# EAGLE design lightsaber (EAGLE 8.2.2)
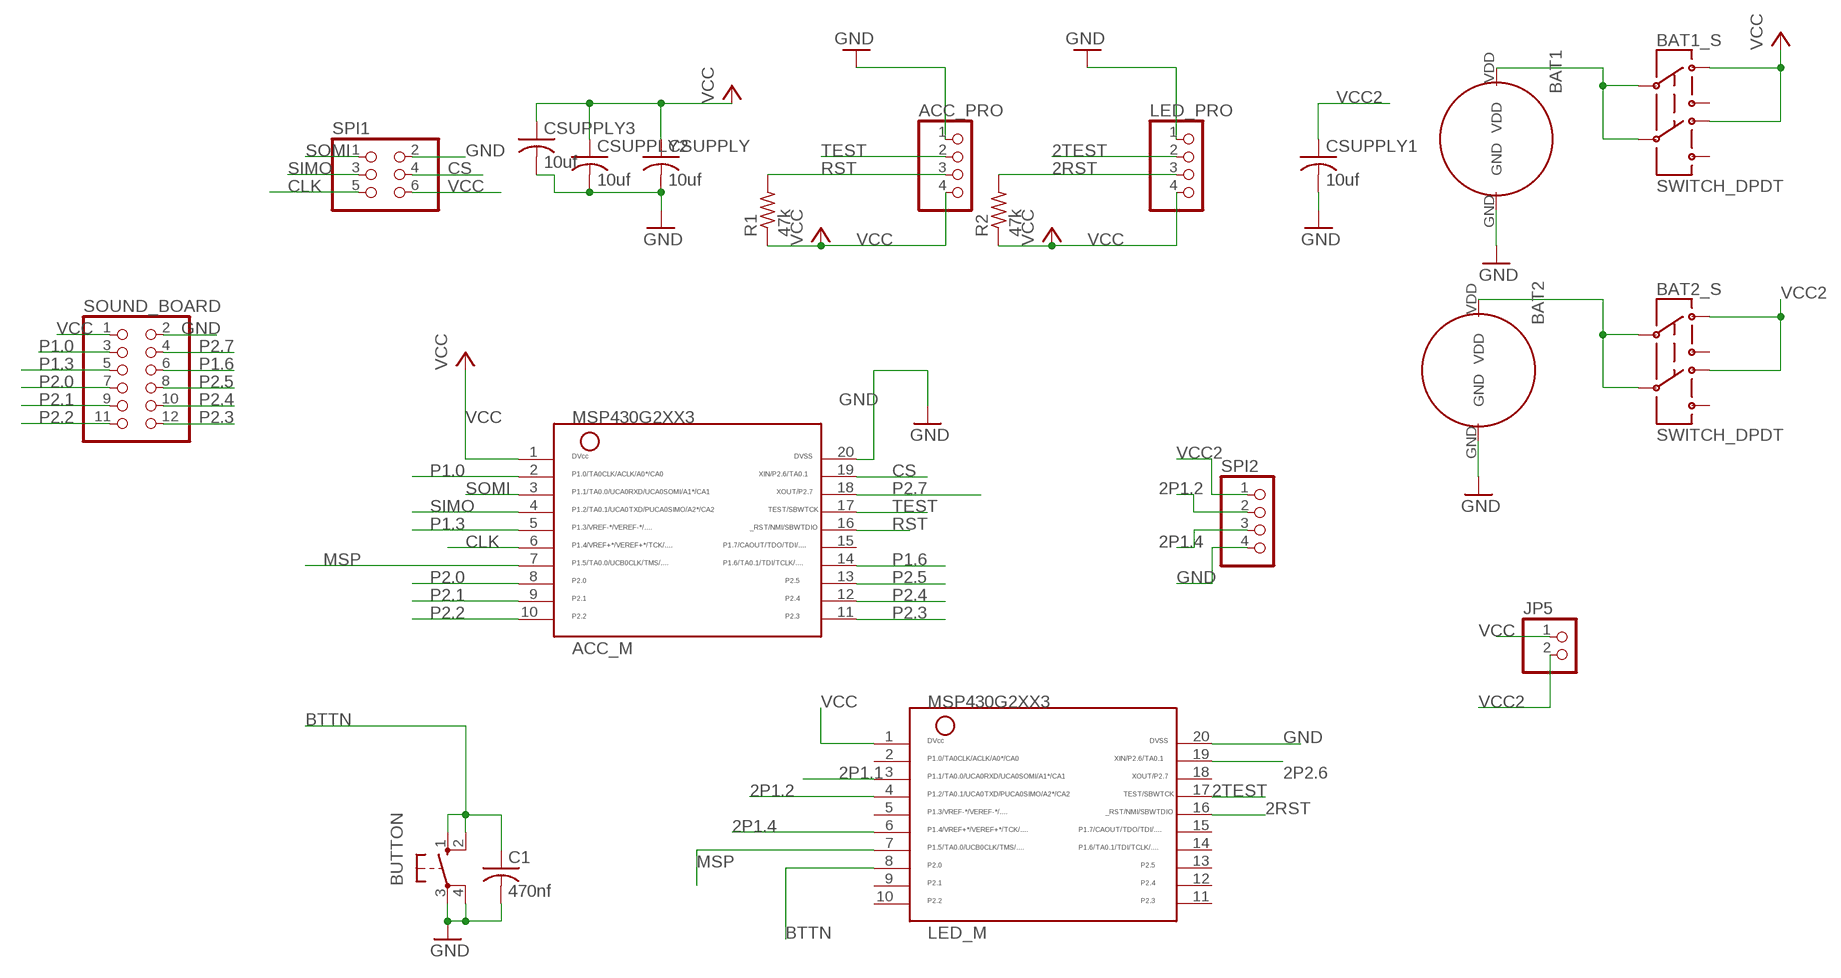
[diagram p0: schematic, sheet 1]

## Parts
ACC_M  MSP430G2XX3TSSOP  [PW20]
ACC_PRO  PINHD-1X4  [1X04]
BAT1  BAT_PAD  [BATTERY_PAD1]
BAT1_S  SWITCH_DPDT  [JS_DPDT_TH]
BAT2  BAT_PAD  [BATTERY_PAD1]
BAT2_S  SWITCH_DPDT  [JS_DPDT_TH]
BUTTON  10-XX  [B3F-10XX]
C1  470nf  C-USC1206  [C1206]
CSUPPLY  10uf  C-USC1206  [C1206]
CSUPPLY1  10uf  C-USC1206  [C1206]
CSUPPLY2  10uf  C-USC1206  [C1206]
CSUPPLY3  10uf  C-USC1206  [C1206]
JP5  PINHD-1X2  [1X02]
LED_M  MSP430G2XX3TSSOP  [PW20]
LED_PRO  PINHD-1X4  [1X04]
R1  47k  R-US_R1206  [R1206]
R2  47k  R-US_R1206  [R1206]
SOUND_BOARD  PINHD-2X6  [2X06]
SPI1  PINHD-2X3  [2X03]
SPI2  PINHD-1X4  [1X04]

## Nets
2P1.1: LED_M.3
2P1.2: LED_M.4 SPI2.2
2P1.4: LED_M.6 SPI2.3
2P2.6: LED_M.19
2RST: LED_M.16 LED_PRO.3 R2.2
2TEST: LED_M.17 LED_PRO.2
BAT_VCC: BAT1.VDD BAT1_S.2 BAT1_S.5
BAT_VCC2: BAT2.VDD BAT2_S.2 BAT2_S.5
BTTN: BUTTON.1(S) BUTTON.2(S1) C1.1 LED_M.8
CLK: ACC_M.6 SPI1.5
CS: ACC_M.19 SPI1.4
GND: ACC_M.20 ACC_PRO.1 BAT1.GND BAT2.GND BUTTON.3(P) BUTTON.4(P1) C1.2 CSUPPLY1.2 CSUPPLY2.2 CSUPPLY3.2 CSUPPLY.2 LED_M.20 LED_PRO.1 SOUND_BOARD.2 SPI1.2 SPI2.4
MSP: ACC_M.7 LED_M.7
P1.0: ACC_M.2 SOUND_BOARD.3
P1.3: ACC_M.5 SOUND_BOARD.5
P1.6: ACC_M.14 SOUND_BOARD.6
P2.0: ACC_M.8 SOUND_BOARD.7
P2.1: ACC_M.9 SOUND_BOARD.9
P2.2: ACC_M.10 SOUND_BOARD.11
P2.3: ACC_M.11 SOUND_BOARD.12
P2.4: ACC_M.12 SOUND_BOARD.10
P2.5: ACC_M.13 SOUND_BOARD.8
P2.7: ACC_M.18 SOUND_BOARD.4
RST: ACC_M.16 ACC_PRO.3 R1.2
SIMO: ACC_M.4 SPI1.3
SOMI: ACC_M.3 SPI1.1
TEST: ACC_M.17 ACC_PRO.2
VCC: ACC_M.1 ACC_PRO.4 BAT1_S.1 BAT1_S.4 CSUPPLY2.1 CSUPPLY3.1 CSUPPLY.1 JP5.1 LED_M.1 LED_PRO.4 R1.1 R2.1 SOUND_BOARD.1 SPI1.6
VCC2: BAT2_S.1 BAT2_S.4 CSUPPLY1.1 JP5.2 SPI2.1
Unconnected: ACC_M.15 BAT1_S.3 BAT1_S.6 BAT2_S.3 BAT2_S.6 LED_M.2 LED_M.5 LED_M.9 LED_M.10 LED_M.11 LED_M.12 LED_M.13 LED_M.14 LED_M.15 LED_M.18

## Library data of the parts
ACC_M LED_M = ELEC327:MSP430G2XX3: MSP430G2XX3 PDIP (N) 20 Pin Package
ACC_PRO LED_PRO SPI2 = pinhead:PINHD-1X4: PIN HEADER
BAT1 BAT2 = BAT_PAD:BAT_PAD
BAT1_S BAT2_S = ELEC327:SWITCH_DPDT
BUTTON = switch-omron:10-XX: OMRON SWITCH; MPN: B3F-1000; OC_FARNELL: 176432; OC_NEWARK: 36M3542
C1 CSUPPLY CSUPPLY1-CSUPPLY3 = rcl:C-US: CAPACITOR, American symbol
JP5 = pinhead:PINHD-1X2: PIN HEADER
R1 R2 = resistor:R-US_: RESISTOR, American symbol
SOUND_BOARD = pinhead:PINHD-2X6: PIN HEADER
SPI1 = pinhead:PINHD-2X3: PIN HEADER

## Board
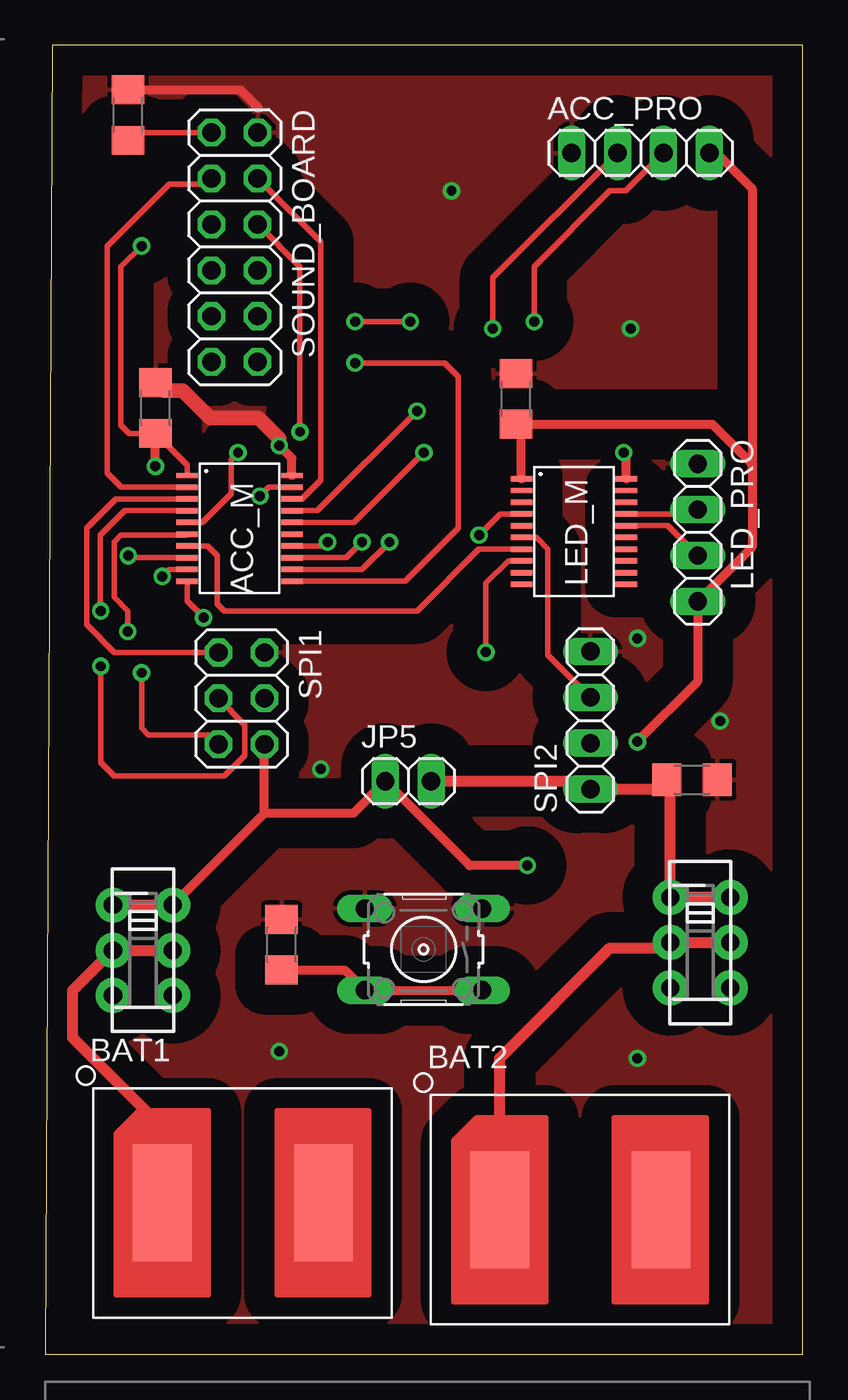
[diagram p1: board, top side]
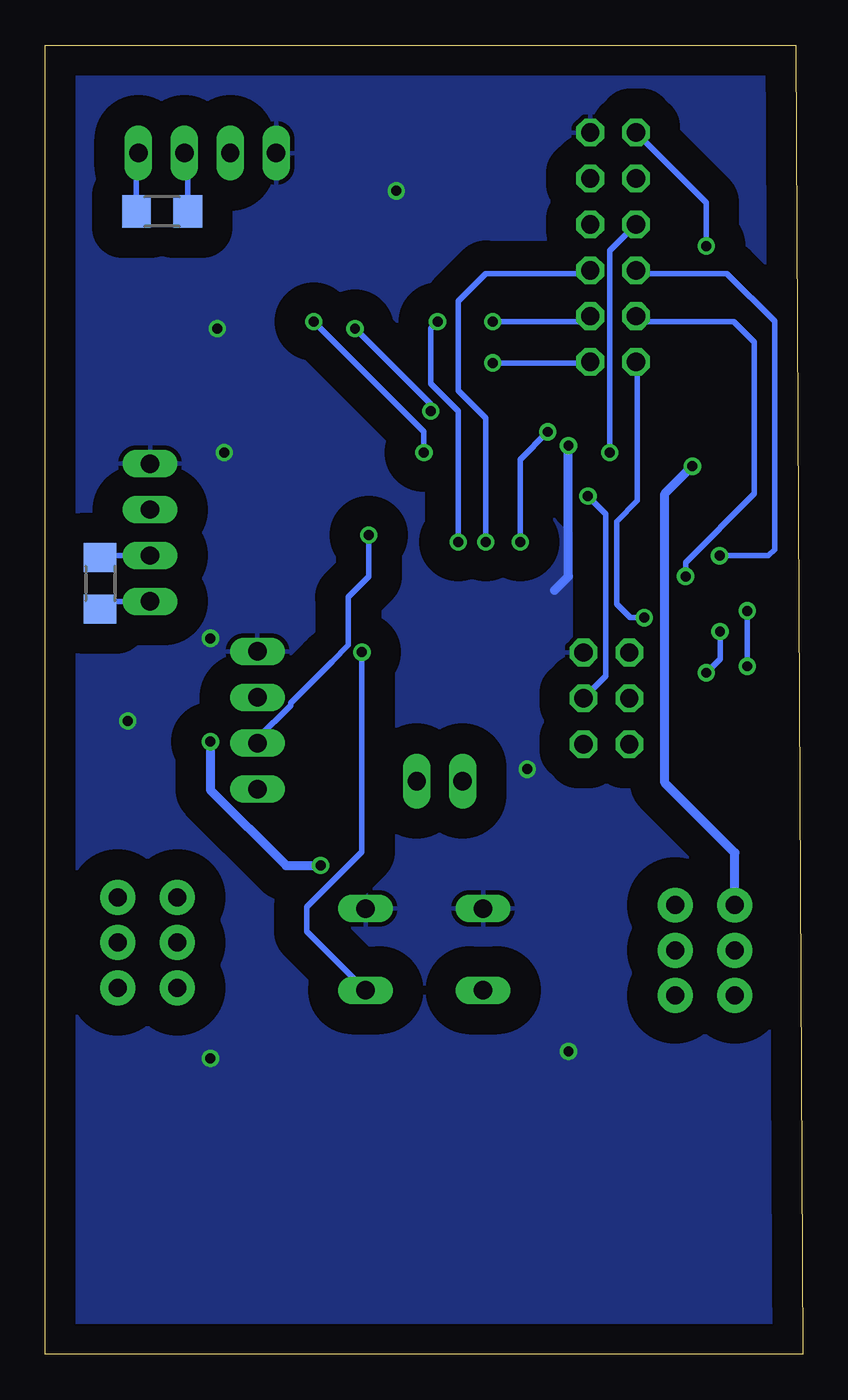
[diagram p2: board, bottom side, seen from below]

Size 41.91 x 72.45 mm. Coordinates in mm from the lower left corner, seen from the top.
Outline: 0,0 41.91,0 41.91,72.45 0.38,72.45 0,0
Copper layers (1*16): Top 0.035mm / dielectric 1.5mm / Bottom 0.035mm
Design rules "default": minimum track width 6mil, minimum drill 0.35mm, track to track 6mil, track to pad 6mil, pad to pad 6mil, via to via 6mil, smd to smd 6mil, copper to edge 40mil, drill to drill 6mil, minimum pad ring 10mil, minimum via ring 8mil, stop-mask expansion 4mil, vias tented up to drill 0mil, thermal gap 10mil

### Footprints (pad centres in the part's own frame; a part is rotated, then mirrored left to right if it is on the bottom)
PW20 = smd 0.3 x 1.2: 1 -2.925,-2.9; 2 -2.275,-2.9; 3 -1.625,-2.9; 4 -0.975,-2.9; 5 -0.325,-2.9; 6 0.325,-2.9; 7 0.975,-2.9; 8 1.625,-2.9; 9 2.275,-2.9; 10 2.925,-2.9; 11 2.925,2.9; 12 2.275,2.9; 13 1.625,2.9; 14 0.975,2.9; 15 0.325,2.9; 16 -0.325,2.9; 17 -0.975,2.9; 18 -1.625,2.9; 19 -2.275,2.9; 20 -2.925,2.9
1X04 = drill 1.016 long: 1 -3.81,0; 2 -1.27,0; 3 1.27,0; 4 3.81,0
BATTERY_PAD1 = smd 3.251 x 6.452: GND 8.92,0; VDD 0,0
JS_DPDT_TH = drill 1 pad 1.93: 1 -2.5,-1.65; 2 0,-1.65; 3 2.5,-1.65; 4 -2.5,1.65; 5 0,1.65; 6 2.5,1.65
B3F-10XX = drill 1.016 long: 1 -3.251,2.261; 2 3.251,2.261; 3 -3.251,-2.261; 4 3.251,-2.261
C1206 = smd 1.6 x 1.8: 1 -1.4,0; 2 1.4,0
1X02 = drill 1.016 long: 1 -1.27,0; 2 1.27,0
R1206 = smd 1.6 x 1.803: 1 -1.422,0; 2 1.422,0
2X06 = drill 1.016 octagon: 1 -6.35,-1.27; 2 -6.35,1.27; 3 -3.81,-1.27; 4 -3.81,1.27; 5 -1.27,-1.27; 6 -1.27,1.27; 7 1.27,-1.27; 8 1.27,1.27; 9 3.81,-1.27; 10 3.81,1.27; 11 6.35,-1.27; 12 6.35,1.27
2X03 = drill 1.016 octagon: 1 -2.54,-1.27; 2 -2.54,1.27; 3 0,-1.27; 4 0,1.27; 5 2.54,-1.27; 6 2.54,1.27

### Placement (x,y rotation side)
ACC_M  10.75,45.71 270 top
ACC_PRO  32.94,66.49 0 top
BAT1  6.48,8.38 0 top
BAT1_S  5.4,22.36 270 top
BAT2  25.15,8 0 top
BAT2_S  36.24,22.79 270 top
BUTTON  20.93,22.41 180 top
C1  13.08,22.67 90 top
CSUPPLY  6.11,52.37 90 top
CSUPPLY1  35.79,31.8 0 top
CSUPPLY2  26.05,52.88 90 top
CSUPPLY3  4.57,68.58 90 top
JP5  20.08,31.72 0 top
LED_M  29.25,45.53 270 top
LED_PRO  36.1,45.48 270 top
R1  35.43,63.25 0 bottom
R2  38.86,42.67 90 bottom
SOUND_BOARD  10.48,61.27 270 top
SPI1  10.86,36.3 270 top
SPI2  30.16,35.09 90 top

### Tracks (layer width: path | path; a pad name or v marks a point on that pad's centre or on a via)
2P1.2  (via drill 0.55)
  Top 0.305: LED_M.4 25.17,46.51 v24,45.34
  Bottom 0.305: v24,45.34 24,43.05 25.15,41.91 25.15,39.24 26.04,38.35 | 26.04,38.35 26.29,38.1 | 26.04,38.35 28.33,36.06 28.33,35.92 30.16,34.09 SPI2.2
2P1.4
  Top 0.305: LED_M.6 27.18,45.2 27.81,44.58 27.81,38.71 SPI2.3
2RST
  Top 0.305: LED_M.16 34.46,45.85 LED_PRO.3
  Bottom 0.305: LED_PRO.3 38.75,44.21 R2.2
2TEST
  Top 0.305: LED_M.17 35.86,46.51 LED_PRO.2
BAT_VCC
  Top 0.61: BAT1_S.5 BAT1_S.2 1.52,20.13 1.52,17.53 6.48,12.57 BAT1.VDD
BAT_VCC2
  Top 0.61: BAT2.VDD 25.15,16.38 31.24,22.48 34.28,22.48 BAT2_S.2 BAT2_S.5
BTTN  (via drill 0.55)
  Top 0.305: LED_M.8 25.62,43.91 24.38,42.67 v24.38,38.86
  Top 0.508: C1.1 16.56,21.27 BUTTON.2 BUTTON.1
  Bottom 0.305: v24.38,38.86 24.38,27.81 27.43,24.77 27.43,23.4 BUTTON.1
CLK  (via drill 0.55)
  Top 0.305: v5.33,37.72 5.33,34.67 5.71,34.29 9.06,34.29 SPI1.5 | v4.57,40.01 4.57,41.15 3.81,41.91 3.81,44.96 4.19,45.34 7.81,45.34 ACC_M.6
  Bottom 0.305: v4.57,40.01 4.57,38.48 v5.33,37.72
CS  (via drill 0.55)
  Top 0.305: ACC_M.19 12.37,47.98 v11.88,47.5
  Bottom 0.305: SPI1.4 10.88,37.55 10.88,46.5 v11.88,47.5
GND  (via drill 0.55)
  Top 0.508: CSUPPLY3.2 10.79,69.98 11.81,68.96 | LED_M.20 32.15,49.76 v32,49.91 | ACC_M.20 13.65,49.59 v12.95,50.29
  Top 0.813: v12.95,50.29 12.95,50.67 11.81,51.82 9.14,51.82 7.62,53.34 6.53,53.34 CSUPPLY.2
  Bottom 0.508: v12.95,50.29 12.95,43.05 13.72,42.29
  other vias: 32.77,39.62 37.34,35.05 15.24,32.38 22.48,64.39 32.38,56.77 12.95,16.76 32.77,16.38
  pour Top (isolate 1.676): 0,-1 0.38,72.57 42.02,72.57 42.02,-1
  pour Bottom (isolate 1.676): 0,-1 0.38,72.57 42.02,72.57 42.02,-1
MSP
  Top 0.305: ACC_M.7 8.99,44.73 9.53,44.2 9.53,41.53 9.91,41.15 20.57,41.15 23.98,44.56 LED_M.7 26.33,44.58
P1.0
  Top 0.305: ACC_M.2 4.21,47.98 3.43,48.77 3.43,61.34 6.86,64.77 8.9,64.77 SOUND_BOARD.3
P1.3  (via drill 0.55)
  Top 0.305: ACC_M.5 8.7,46.03 10.29,47.62 10.29,49.53 v10.67,49.91
  Bottom 0.305: v10.67,49.91 10.67,61.08 SOUND_BOARD.5
P1.6  (via drill 0.55)
  Top 0.305: ACC_M.14 15.4,44.73 v15.62,44.96 | v14.1,51.05 14.1,60.19 SOUND_BOARD.6
  Bottom 0.305: v15.62,44.96 15.62,49.53 v14.1,51.05
P2.0  (via drill 0.55)
  Top 0.305: ACC_M.8 4.7,44.09 v4.59,44.2
  Bottom 0.305: v4.59,44.2 1.91,44.2 1.55,44.55 1.55,57.17 4.19,59.82 9.03,59.82 SOUND_BOARD.7
P2.1  (via drill 0.55)
  Top 0.305: ACC_M.9 6.86,43.44 v6.48,43.05
  Bottom 0.305: v6.48,43.05 6.48,43.81 2.67,47.62 2.67,56.01 3.81,57.15 8.9,57.15 SOUND_BOARD.9
P2.2  (via drill 0.55)
  Top 0.305: ACC_M.10 7.85,41.68 v8.76,40.77
  Bottom 0.305: v8.76,40.77 9.53,40.77 10.29,41.53 10.29,46.1 9.14,47.24 9.14,54.85 SOUND_BOARD.11
P2.3  (via drill 0.55)
  Top 0.305: 22.61,54.35 22.86,54.1 | 22.61,54.35 22.1,54.86 v17.14,54.86 | 22.86,54.1 22.86,45.72 19.93,42.78 ACC_M.11 | 22.86,54.1 22.61,54.35
  Bottom 0.305: v17.14,54.86 11.8,54.86 SOUND_BOARD.12
P2.4  (via drill 0.55)
  Top 0.305: v20.19,57.15 v17.14,57.15 | v19.05,44.96 17.53,43.44 ACC_M.12
  Bottom 0.305: v20.19,57.15 20.57,56.77 20.57,53.72 19.05,52.2 v19.05,44.96 | v17.14,57.15 12.06,57.15 SOUND_BOARD.10
P2.5  (via drill 0.55)
  Top 0.305: v17.53,44.96 16.65,44.09 ACC_M.13
  Bottom 0.305: SOUND_BOARD.8 11.93,59.82 17.53,59.82 19.05,58.29 19.05,53.34 17.53,51.82 v17.53,44.96
P2.7
  Top 0.305: ACC_M.18 14.19,47.34 15.24,48.39 15.24,61.59 SOUND_BOARD.4
RST  (via drill 0.55)
  Top 0.305: ACC_M.16 17.08,46.03 v20.96,49.91 | v27.05,57.15 27.05,60.2 31.24,64.39 32.11,64.39 ACC_PRO.3
  Bottom 0.305: v20.96,49.91 20.96,51.05 v27.05,57.15 | R1.2 34.01,66.29 ACC_PRO.3
SIMO  (via drill 0.55)
  Top 0.305: ACC_M.4 4.39,46.69 3.05,45.34 3.05,41.17 v3.07,41.15 | v3.07,38.08 3.07,32.74 3.81,32 9.91,32 11.05,33.15 11.05,34.84 SPI1.3
  Bottom 0.305: v3.07,41.15 v3.07,38.08
SOMI
  Top 0.305: SPI1.1 3.83,38.84 2.29,40.39 2.29,45.72 3.9,47.34 ACC_M.3
TEST  (via drill 0.55)
  Top 0.305: ACC_M.17 15.06,46.69 v20.57,52.2 | v24.77,56.77 24.77,59.59 ACC_PRO.2
  Bottom 0.305: v20.57,52.2 20.57,52.58 v24.77,56.77
VCC  (via drill 0.55)
  Top 0.305: ACC_M.1 7.85,49.22 CSUPPLY.1 4.66,50.97 4.19,51.44 4.19,60.2 v5.33,61.34 | 26.19,51.34 CSUPPLY2.1 | SOUND_BOARD.1 5.01,67.62 CSUPPLY3.1
  Top 0.508: 12.13,29.94 17.03,29.94 JP5.1 23.48,27.05 v26.67,27.05 | v6.1,49.15 CSUPPLY.1 | CSUPPLY2.1 36.91,51.48 39.11,49.28 39.11,48.78 | 39.11,48.78 39.11,44.68 LED_PRO.4 36.1,37.24 v32.77,33.91 | BAT1_S.4 12.13,29.94 | 12.13,29.94 SPI1.6 | LED_M.1 26.35,51.18 26.19,51.34 | ACC_PRO.4 37.14,66.49 39.11,64.52 39.11,48.78
  Top 0.61: BAT1_S.1 BAT1_S.4 7.09,24.9
  Bottom 0.305: v5.33,61.34 5.33,63.74 SOUND_BOARD.1 | LED_PRO.4 38.44,41.67 R2.1 | R1.1 36.85,66.38 ACC_PRO.4
  Bottom 0.508: BAT1_S.1 3.75,27.75 7.62,31.62 7.62,47.62 v6.1,49.15 | SPI1.6 12.13,33.87 | v32.77,33.91 32.77,31.24 28.57,27.05 v26.67,27.05
VCC2
  Top 0.508: CSUPPLY1.1 34.59,31.6
  Top 0.61: BAT2_S.4 BAT2_S.1 34.59,31.6 | CSUPPLY1.1 33.87,31.28 SPI2.1 29.72,31.72 JP5.2